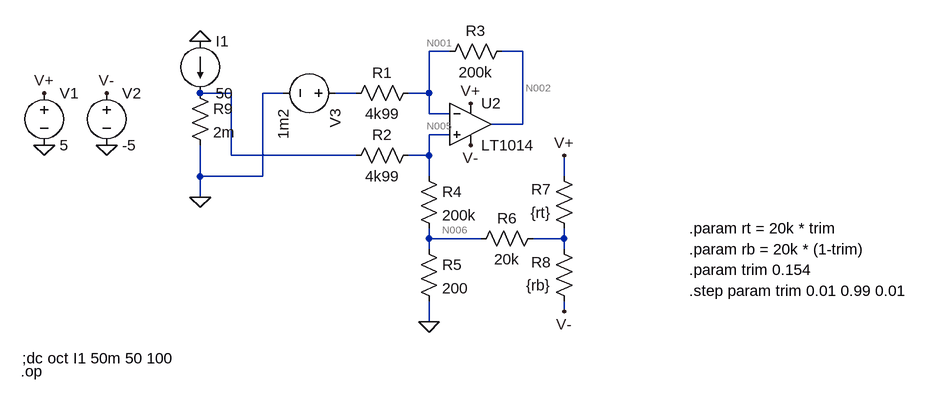
[diagram p0: schematic Opamp trimming.asc]
Opamp trimming.asc, the LTspice schematic file:
Version 4
SHEET 1 880 680
WIRE -144 128 -176 128
WIRE -32 128 -64 128
WIRE -480 192 -528 192
WIRE -400 192 -432 192
WIRE -288 192 -320 192
WIRE -176 192 -176 128
WIRE -176 192 -208 192
WIRE -176 224 -176 192
WIRE -144 224 -176 224
WIRE -32 240 -32 128
WIRE -32 240 -80 240
WIRE -144 256 -176 256
WIRE -480 288 -480 192
WIRE -288 288 -480 288
WIRE -176 288 -176 256
WIRE -176 288 -208 288
WIRE -528 320 -528 272
WIRE -432 320 -432 192
WIRE -432 320 -528 320
WIRE -176 320 -176 288
WIRE 32 320 32 288
WIRE -528 352 -528 320
WIRE -176 416 -176 400
WIRE -96 416 -176 416
WIRE 32 416 32 400
WIRE 32 416 -16 416
WIRE -176 432 -176 416
WIRE 32 432 32 416
WIRE 32 528 32 512
WIRE -176 544 -176 512
FLAG -768 192 V+
FLAG -672 192 V-
FLAG -768 272 0
FLAG -672 272 0
FLAG -112 208 V+
FLAG -176 544 0
FLAG -528 352 0
FLAG -528 112 0
FLAG -112 272 V-
FLAG 32 288 V+
FLAG 32 528 V-
SYMBOL voltage -768 176 R0
WINDOW 123 0 0 Left 2
WINDOW 39 0 0 Left 2
SYMATTR InstName V1
SYMATTR Value 5
SYMBOL voltage -672 176 R0
WINDOW 123 0 0 Left 2
WINDOW 39 0 0 Left 2
SYMATTR InstName V2
SYMATTR Value -5
SYMBOL res -192 176 R90
WINDOW 0 0 56 VBottom 2
WINDOW 3 32 56 VTop 2
SYMATTR InstName R1
SYMATTR Value 4k99
SYMBOL res -192 272 R90
WINDOW 0 0 56 VBottom 2
WINDOW 3 32 56 VTop 2
SYMATTR InstName R2
SYMATTR Value 4k99
SYMBOL res -48 112 R90
WINDOW 0 0 56 VBottom 2
WINDOW 3 32 56 VTop 2
SYMATTR InstName R3
SYMATTR Value 200k
SYMBOL res -192 304 R0
SYMATTR InstName R4
SYMATTR Value 200k
SYMBOL res -544 176 R0
SYMATTR InstName R9
SYMATTR Value 2m
SYMBOL current -528 112 R0
WINDOW 123 0 0 Left 2
WINDOW 39 0 0 Left 2
SYMATTR InstName I1
SYMATTR Value 50
SYMBOL Opamps\\LT1014 -112 176 R0
SYMATTR InstName U2
SYMBOL voltage -304 192 R90
WINDOW 123 0 0 Left 2
WINDOW 39 0 0 Left 2
SYMATTR InstName V3
SYMATTR Value 1m2
SYMBOL res -192 416 R0
SYMATTR InstName R5
SYMATTR Value 200
SYMBOL res 0 400 R90
WINDOW 0 0 56 VBottom 2
WINDOW 3 32 56 VTop 2
SYMATTR InstName R6
SYMATTR Value 20k
SYMBOL res 48 416 R180
WINDOW 0 36 76 Left 2
WINDOW 3 36 40 Left 2
SYMATTR InstName R7
SYMATTR Value {rt}
SYMBOL res 48 528 R180
WINDOW 0 36 76 Left 2
WINDOW 3 36 40 Left 2
SYMATTR InstName R8
SYMATTR Value {rb}
TEXT 224 400 Left 2 !.param rt = 20k * trim
TEXT 224 432 Left 2 !.param rb = 20k * (1-trim)
TEXT 224 464 Left 2 !.param trim 0.154
TEXT -802 600 Left 2 !;dc oct I1 50m 50 100
TEXT 224 496 Left 2 !.step param trim 0.01 0.99 0.01
TEXT -804 620 Left 2 !.op

The netlist it stands for:
* Opamp trimming.asc
V1 V+ 0 5
V2 V- 0 -5
R1 N001 N004 4k99
R2 N005 N003 4k99
R3 N002 N001 200k
R4 N005 N006 200k
R9 N003 0 2m
I1 0 N003 50
XU2 N005 N001 V+ V- N002 LT1014  ; pins In+ In- V+ V- OUT
V3 N004 0 1m2
R5 N006 0 200
R6 N007 N006 20k
R7 N007 V+ {rt}
R8 V- N007 {rb}
.param rt = 20k * trim
.param rb = 20k * (1-trim)
.param trim 0.154
;dc oct I1 50m 50 100
.step param trim 0.01 0.99 0.01
.op
.backanno
.end

* Results of the author's LTspice run, read from the files saved beside the schematic
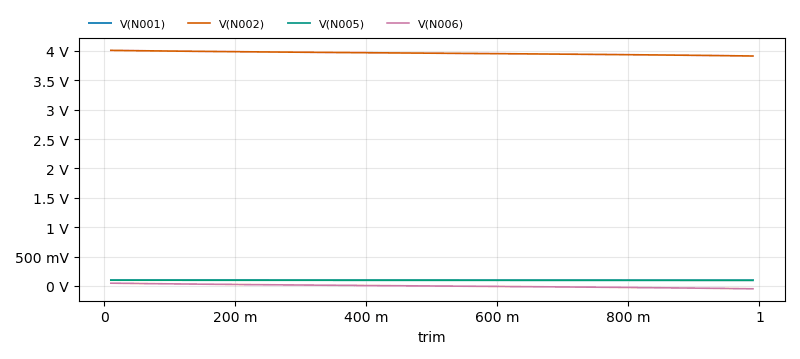
[diagram p1: Operating Point of Opamp trimming.asc, plotted from the saved traces]
* Operating Point, 1 run:
*   V(N001): 98.79 mV at trim=10 m, 96.46 mV at trim=990 m, min 96.46 mV, max 98.79 mV
*   V(N002): 4.008 V at trim=10 m, 3.912 V at trim=990 m, min 3.912 V, max 4.008 V
*   V(N005): 98.79 mV at trim=10 m, 96.46 mV at trim=990 m, min 96.46 mV, max 98.79 mV
*   V(N006): 48.09 mV at trim=10 m, -47.9 mV at trim=990 m, min -47.9 mV, max 48.09 mV
* From the log:
*   Semiconductor Device Operating Points:
*                           --- Diodes ---
*   Name:    d:u2:3      d:u2:2      d:u2:6      d:u2:5      d:u2:4
*   Model:  u2:dbias    u2:dbias      u2:yd       u2:yu       u2:xd
*   Id:     -1.20e-08   -1.20e-08   -2.79e-15    2.79e-15   -9.91e-11
*   Vd:     -4.90e+00   -4.90e+00   -1.40e-03    1.40e-03   -9.01e+00
*   Req:     1.00e-03    1.00e-03    1.00e-12    1.00e-12    1.00e-11
*   CAP:     0.00e+00    0.00e+00    0.00e+00    0.00e+00    0.00e+00
*   Name:    d:u2:1
*   Model:    u2:xu
*   Id:     -1.09e-11
*   Vd:     -9.91e-01
*   Req:     1.00e-11
*   CAP:     0.00e+00
*                           --- VDMOSFET Transistors ---
*   Name:        m:u2:2      m:u2:1
*   Model:        u2:p        u2:n
*   Id:         -3.40e-04    3.60e-04
*   Vgs:         1.40e-03    1.40e-03
*   Vds:        -9.01e+00    9.92e-01
*   Vth:         1.00e-01   -1.00e-01
*   Gm:          6.90e-03    7.10e-03
*   Gds:         0.00e+00    0.00e+00
*   Cgs:         0.00e+00    0.00e+00
*   Cgd:         0.00e+00    0.00e+00
*   Cbody:       0.00e+00    0.00e+00